# Altium schematic sheet Sheet1.SchDoc
size A1
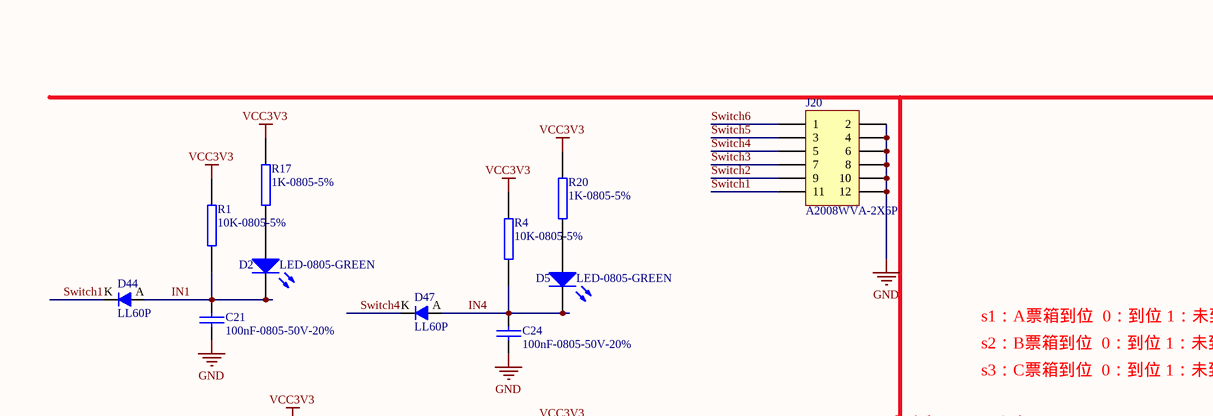
[diagram p0: Sheet1.SchDoc, top left]
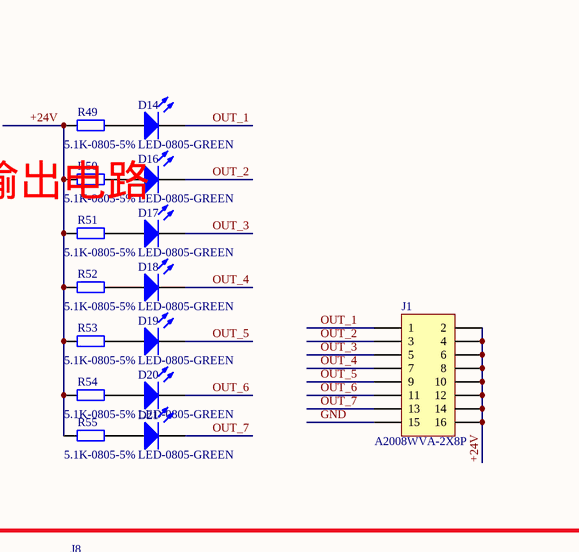
[diagram p1: Sheet1.SchDoc, top middle]
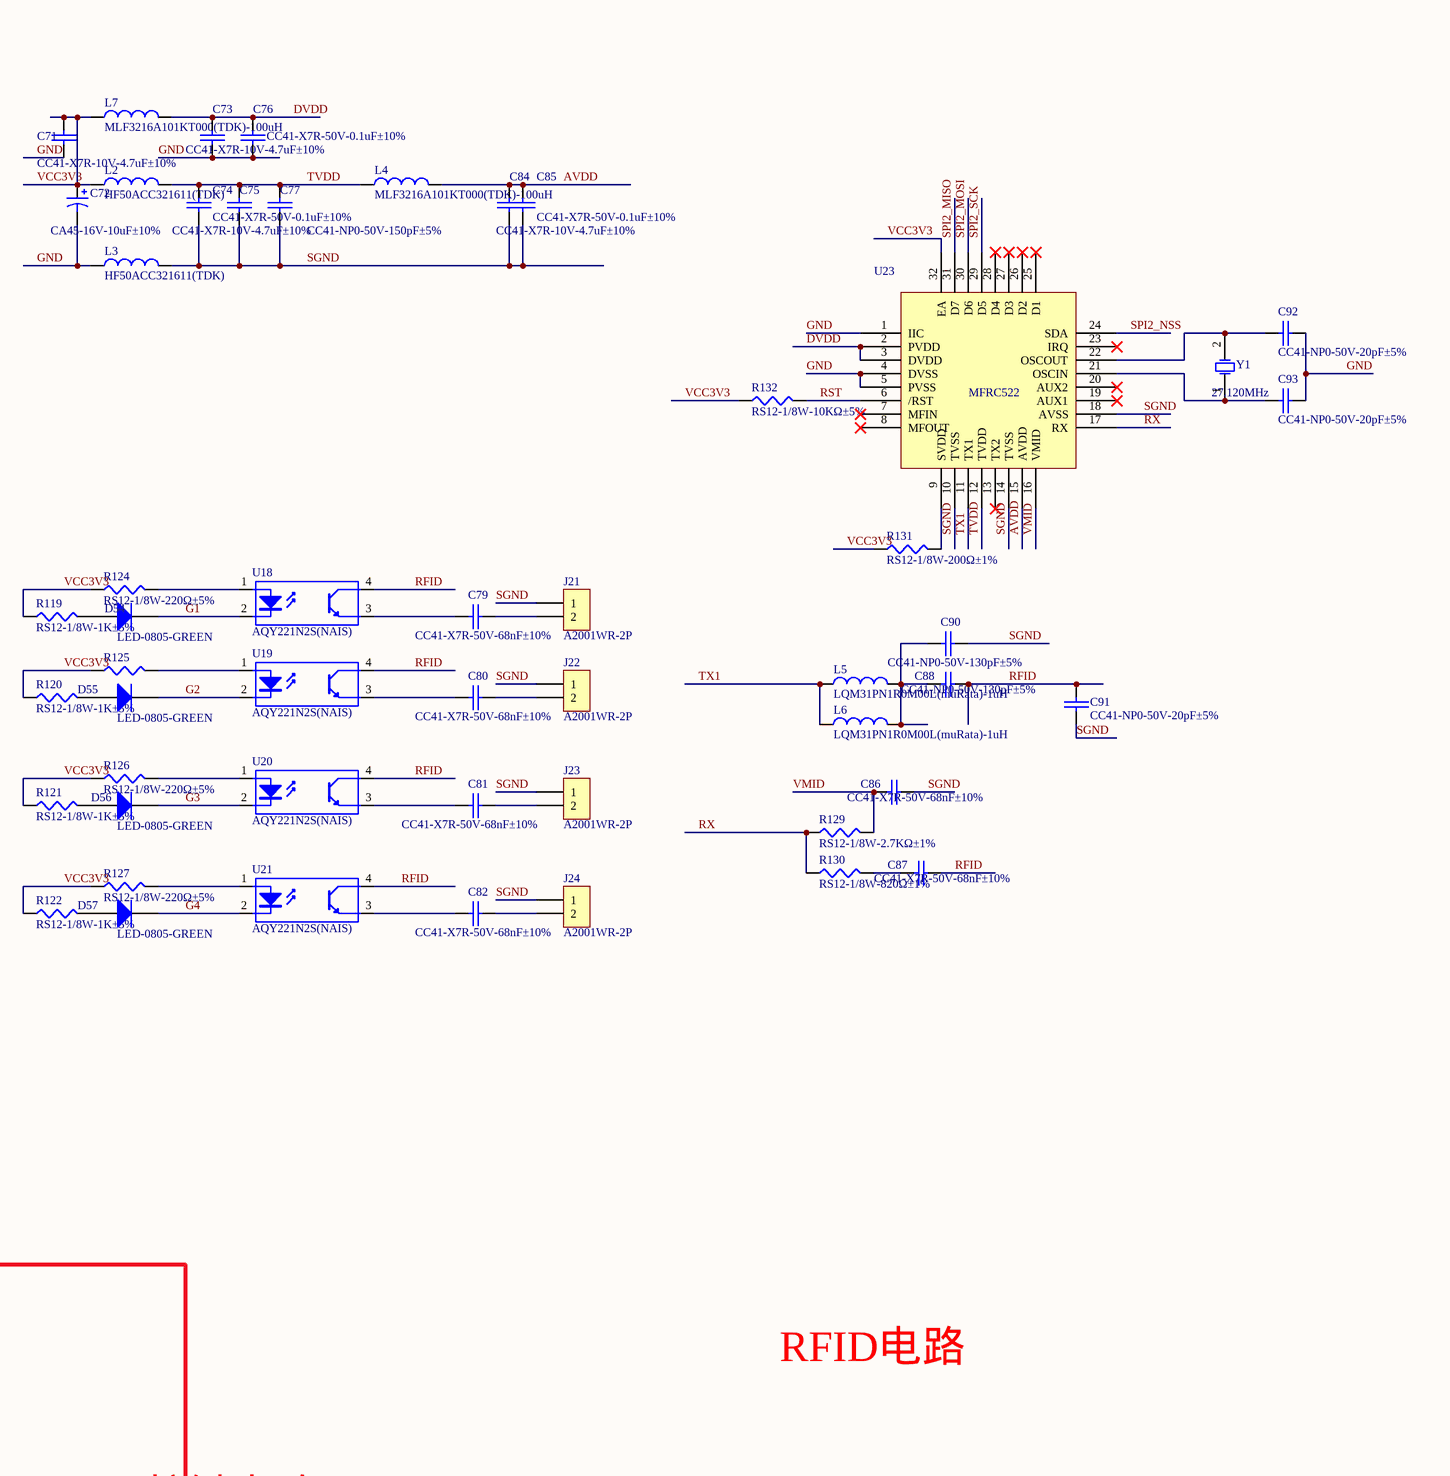
[diagram p2: Sheet1.SchDoc, top right]
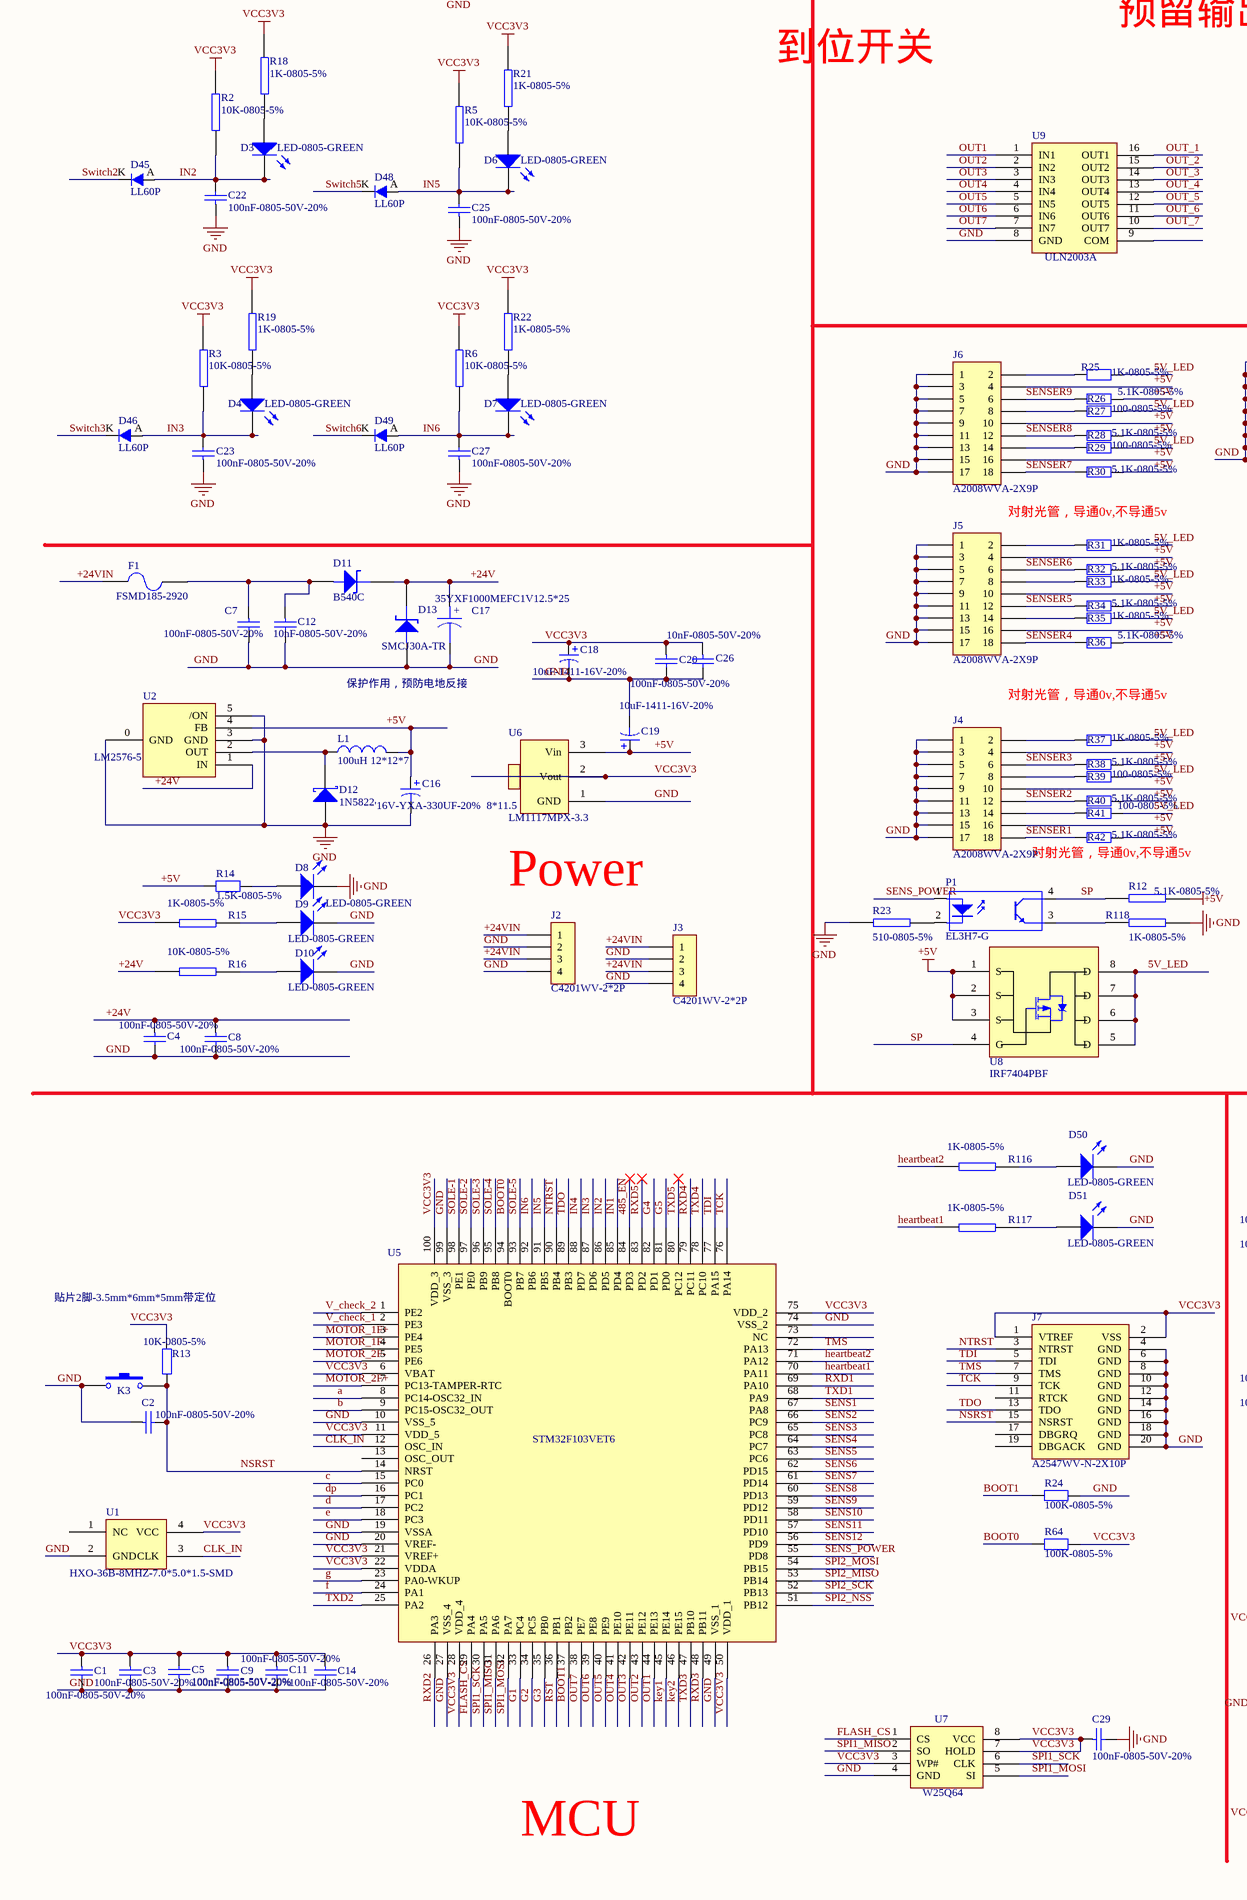
[diagram p3: Sheet1.SchDoc, bottom left]
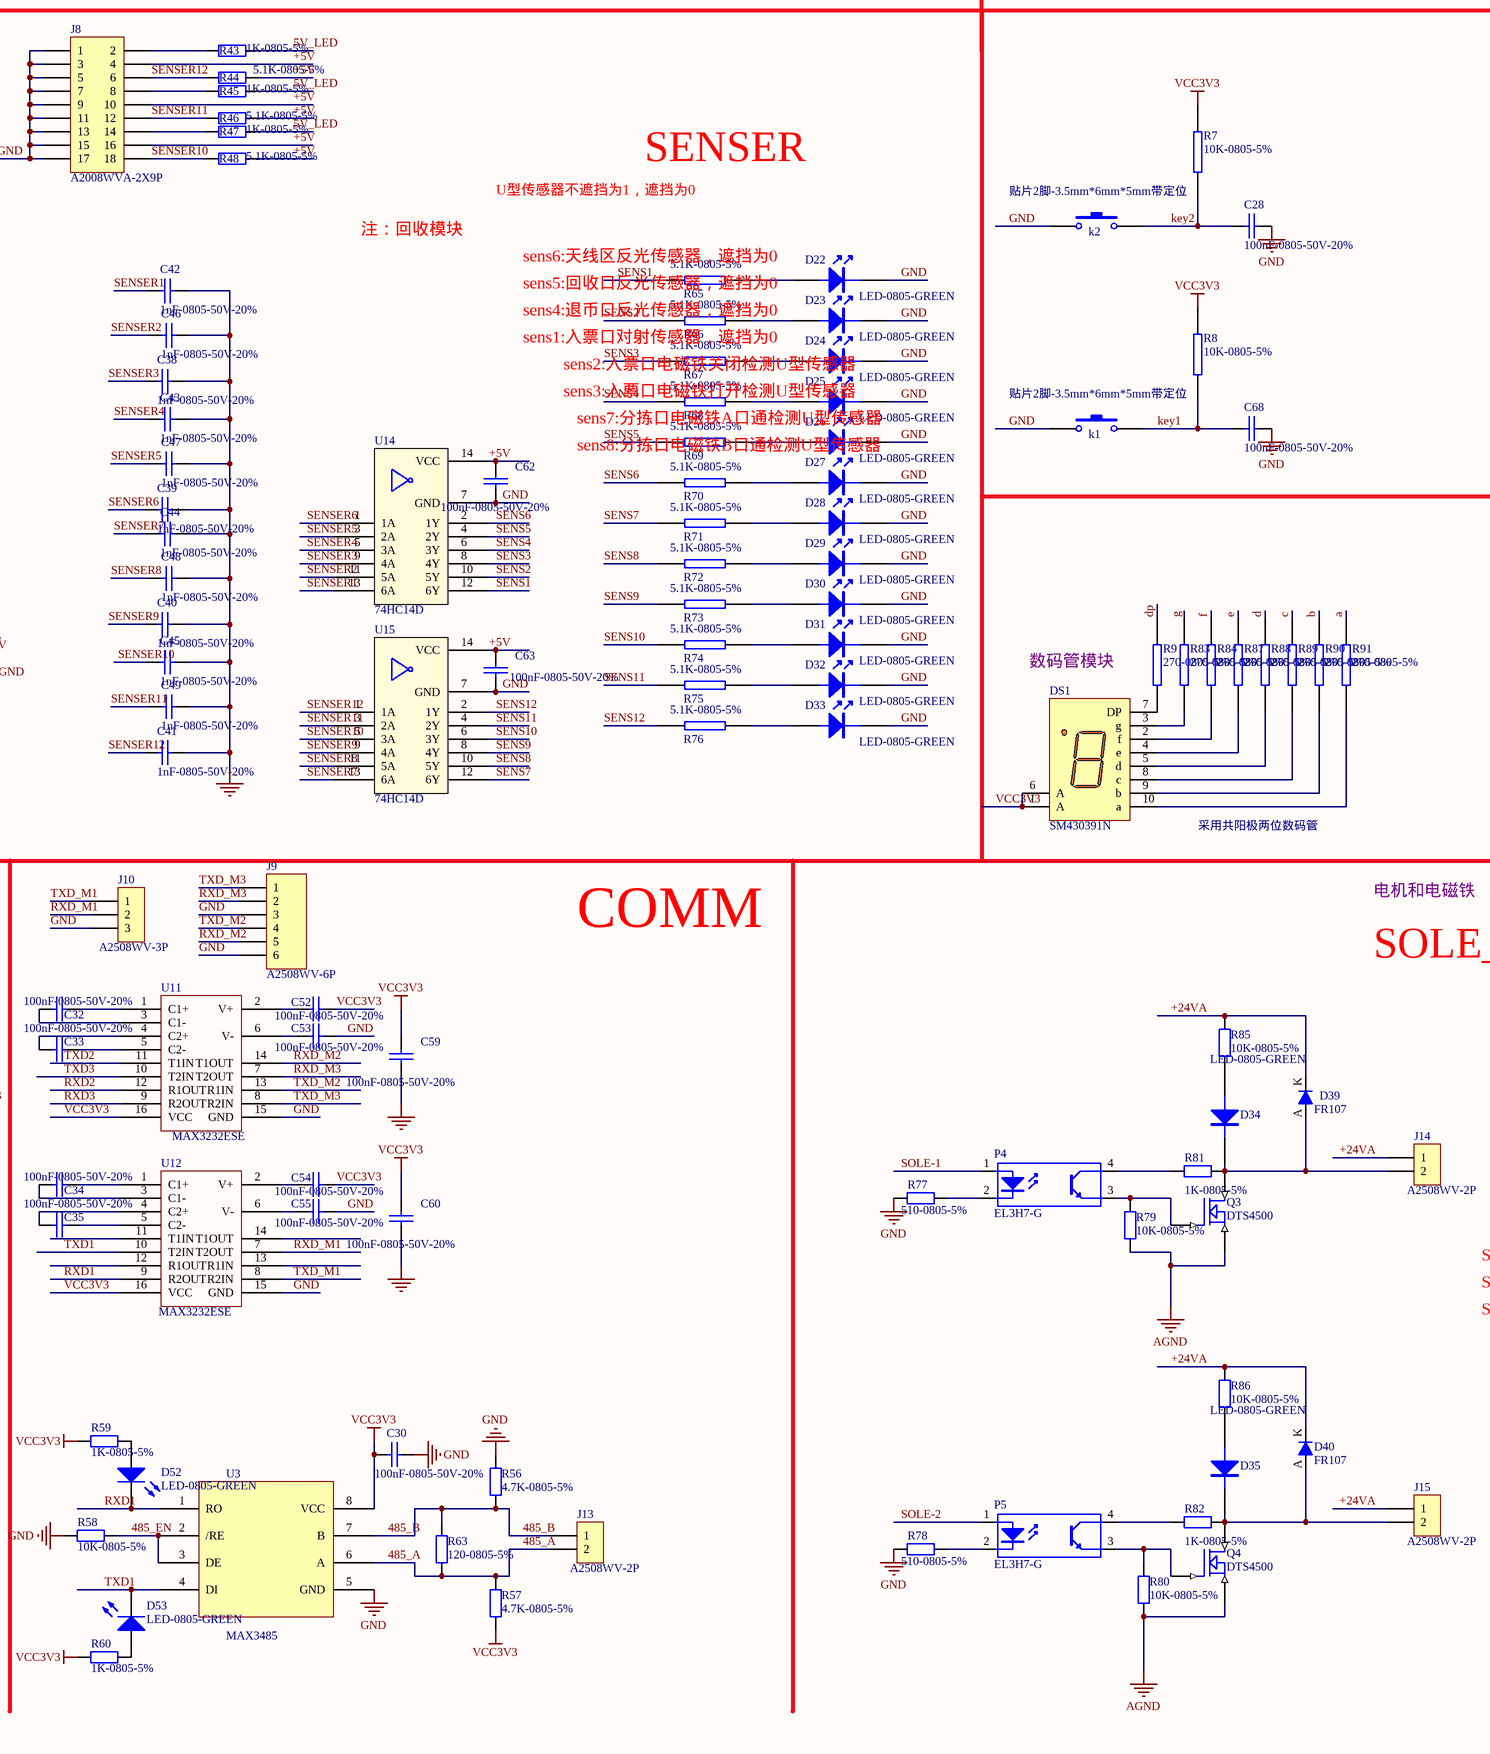
[diagram p4: Sheet1.SchDoc, bottom middle]
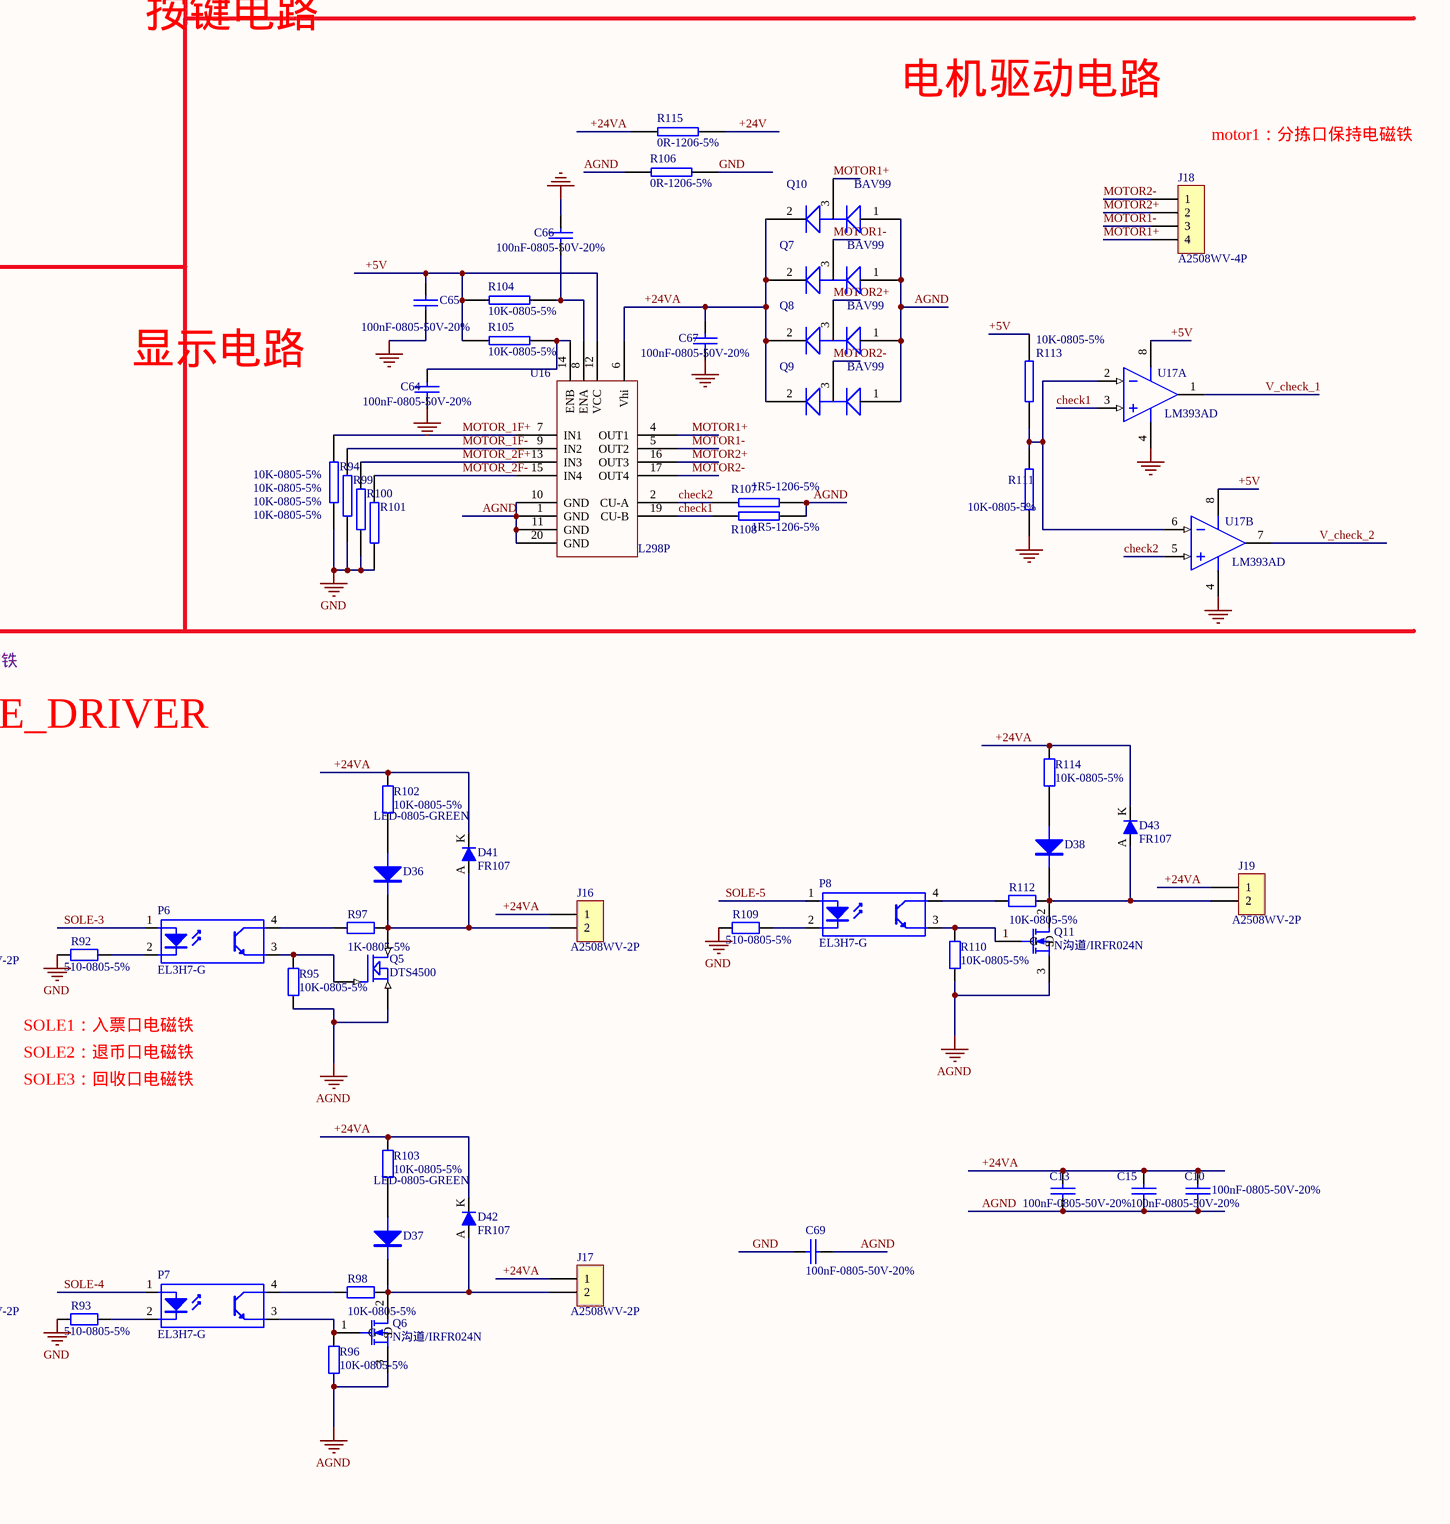
[diagram p5: Sheet1.SchDoc, bottom right]

## Parts
C1  100nF-0805-50V-20%  [0805]
C2  100nF-0805-50V-20%  [0805]
C3  100nF-0805-50V-20%  [0805]
C4  100nF-0805-50V-20%  [0805]
C5  100nF-0805-50V-20%  [0805]
C7  100nF-0805-50V-20%  [0805]
C8  100nF-0805-50V-20%  [0805]
C9  100nF-0805-50V-20%  [0805]
C10  100nF-0805-50V-20%  [0805]
C11  100nF-0805-50V-20%  [0805]
C12  10nF-0805-50V-20%  [0805]
C13  100nF-0805-50V-20%  [0805]
C14  100nF-0805-50V-20%  [0805]
C15  100nF-0805-50V-20%  [0805]
C16  '16V-YXA-330UF-20%  8*11.5  [RB.2/.4 - 8MM]
C17  35YXF1000MEFC1V12.5*25  [RB.2/.4]
C18  10uF-1411-16V-20%  [1411-B]
C19  10uF-1411-16V-20%  [1411-B]
C20  100nF-0805-50V-20%  [0805]
C21  100nF-0805-50V-20%  [0805]
C22  100nF-0805-50V-20%  [0805]
C23  100nF-0805-50V-20%  [0805]
C24  100nF-0805-50V-20%  [0805]
C25  100nF-0805-50V-20%  [0805]
C26  10nF-0805-50V-20%  [0805]
C27  100nF-0805-50V-20%  [0805]
C28  100nF-0805-50V-20%  [0805]
C29  100nF-0805-50V-20%  [0805]
C30  100nF-0805-50V-20%  [0805]
C32  100nF-0805-50V-20%  [0805]
C33  100nF-0805-50V-20%  [0805]
C34  100nF-0805-50V-20%  [0805]
C35  100nF-0805-50V-20%  [0805]
C38  1nF-0805-50V-20%  [0805]
C39  1nF-0805-50V-20%  [0805]
C40  1nF-0805-50V-20%  [0805]
C41  1nF-0805-50V-20%  [0805]
C42  1nF-0805-50V-20%  [0805]
C43  1nF-0805-50V-20%  [0805]
C44  1nF-0805-50V-20%  [0805]
C45  1nF-0805-50V-20%  [0805]
C46  1nF-0805-50V-20%  [0805]
C47  1nF-0805-50V-20%  [0805]
C48  1nF-0805-50V-20%  [0805]
C49  1nF-0805-50V-20%  [0805]
C52  100nF-0805-50V-20%  [0805]
C53  100nF-0805-50V-20%  [0805]
C54  100nF-0805-50V-20%  [0805]
C55  100nF-0805-50V-20%  [0805]
C59  100nF-0805-50V-20%  [0805]
C60  100nF-0805-50V-20%  [0805]
C62  100nF-0805-50V-20%  [0805]
C63  100nF-0805-50V-20%  [0805]
C64  100nF-0805-50V-20%  [0805]
C65  100nF-0805-50V-20%  [0805]
C66  100nF-0805-50V-20%  [0805]
C67  100nF-0805-50V-20%  [0805]
C68  100nF-0805-50V-20%  [0805]
C69  100nF-0805-50V-20%  [0805]
C71  CC41-X7R-10V-4.7uF±10%  [1206C]
C72  CA45-16V-10uF±10%  [3216-A]
C73  CC41-X7R-10V-4.7uF±10%  [1206C]
C74  CC41-X7R-10V-4.7uF±10%  [1206C]
C75  CC41-X7R-50V-0.1uF±10%  [0805C]
C76  CC41-X7R-50V-0.1uF±10%  [0805C]
C77  CC41-NP0-50V-150pF±5%  [0805C]
C79  CC41-X7R-50V-68nF±10%  [0805C]
C80  CC41-X7R-50V-68nF±10%  [0805C]
C81  CC41-X7R-50V-68nF±10%  [0805C]
C82  CC41-X7R-50V-68nF±10%  [0805C]
C84  CC41-X7R-10V-4.7uF±10%  [1206C]
C85  CC41-X7R-50V-0.1uF±10%  [0805C]
C86  CC41-X7R-50V-68nF±10%  [0805C]
C87  CC41-X7R-50V-68nF±10%  [0805C]
C88  CC41-NP0-50V-130pF±5%  [0805C]
C90  CC41-NP0-50V-130pF±5%  [0805C]
C91  CC41-NP0-50V-20pF±5%  [0805C]
C92  CC41-NP0-50V-20pF±5%  [0805C]
C93  CC41-NP0-50V-20pF±5%  [0805C]
D2  LED-0805-GREEN  [LED-0805]
D3  LED-0805-GREEN  [LED-0805]
D4  LED-0805-GREEN  [LED-0805]
D5  LED-0805-GREEN  [LED-0805]
D6  LED-0805-GREEN  [LED-0805]
D7  LED-0805-GREEN  [LED-0805]
D8  LED-0805-GREEN  [LED-0805]
D9  LED-0805-GREEN  [LED-0805]
D10  LED-0805-GREEN  [LED-0805]
D11  B540C  [SMC]
D12  1N5822  [IN5822 SMT]
D13  SMCJ30A-TR  [SMC]
D14  LED-0805-GREEN  [LED-0805]
D16  LED-0805-GREEN  [LED-0805]
D17  LED-0805-GREEN  [LED-0805]
D18  LED-0805-GREEN  [LED-0805]
D19  LED-0805-GREEN  [LED-0805]
D20  LED-0805-GREEN  [LED-0805]
D21  LED-0805-GREEN  [LED-0805]
D22  LED-0805-GREEN  [LED-0805]
D23  LED-0805-GREEN  [LED-0805]
D24  LED-0805-GREEN  [LED-0805]
D25  LED-0805-GREEN  [LED-0805]
D26  LED-0805-GREEN  [LED-0805]
D27  LED-0805-GREEN  [LED-0805]
D28  LED-0805-GREEN  [LED-0805]
D29  LED-0805-GREEN  [LED-0805]
D30  LED-0805-GREEN  [LED-0805]
D31  LED-0805-GREEN  [LED-0805]
D32  LED-0805-GREEN  [LED-0805]
D33  LED-0805-GREEN  [LED-0805]
D34  LED-0805-GREEN  [LED-0805]
D35  LED-0805-GREEN  [LED-0805]
D36  LED-0805-GREEN  [LED-0805]
D37  LED-0805-GREEN  [LED-0805]
D38  LED-0805-GREEN  [LED-0805]  (value not drawn)
D39  FR107  [DO-214AC]
D40  FR107  [DO-214AC]
D41  FR107  [DO-214AC]
D42  FR107  [DO-214AC]
D43  FR107  [DO-214AC]
D44  LL60P  [DIODE]
D45  LL60P  [DIODE]
D46  LL60P  [DIODE]
D47  LL60P  [DIODE]
D48  LL60P  [DIODE]
D49  LL60P  [DIODE]
D50  LED-0805-GREEN  [LED-0805]
D51  LED-0805-GREEN  [LED-0805]
D52  LED-0805-GREEN  [LED-0805]
D53  LED-0805-GREEN  [LED-0805]
D54  LED-0805-GREEN  [0805D]
D55  LED-0805-GREEN  [0805D]
D56  LED-0805-GREEN  [0805D]
D57  LED-0805-GREEN  [0805D]
DS1  SM430391N  [LEDDIP-10]
F1  FSMD185-2920  [2920]
J1  A2008WVA-2X8P  [A2008WVA-2X8P]
J2  C4201WV-2*2P  [MX4 .2- 2*2P-180]
J3  C4201WV-2*2P  [MX4 .2- 2*2P-180]
J4  A2008WVA-2X9P  [A2008WVA-2X9P]
J5  A2008WVA-2X9P  [A2008WVA-2X9P]
J6  A2008WVA-2X9P  [A2008WVA-2X9P]
J7  A2547WV-N-2X10P  [JTAG_20]
J8  A2008WVA-2X9P  [A2008WVA-2X9P]
J9  A2508WV-6P  [W143-6]
J10  A2508WV-3P  [H3]
J13  A2508WV-2P  [2.5-2P  180 JXT]
J14  A2508WV-2P  [2.5-2P  180 JXT]
J15  A2508WV-2P  [2.5-2P  180 JXT]
J16  A2508WV-2P  [2.5-2P  180 JXT]
J17  A2508WV-2P  [2.5-2P  180 JXT]
J18  A2508WV-4P  [W143-4]
J19  A2508WV-2P  [2.5-2P  180 JXT]
J20  A2008WVA-2X6P  [A2008WVA-2X6P]
J21  A2001WR-2P  [A2001WR-2P]
J22  A2001WR-2P  [A2001WR-2P]
J23  A2001WR-2P  [A2001WR-2P]
J24  A2001WR-2P  [A2001WR-2P]
k1  贴片2脚-3.5mm*6mm*5mm带定位  [BUTTON2]
k2  贴片2脚-3.5mm*6mm*5mm带定位  [BUTTON2]
K3  贴片2脚-3.5mm*6mm*5mm带定位  [BUTTON2]
L1  100uH 12*12*7  [Inductor SMT7]
L2  HF50ACC321611(TDK)  [1206L]
L3  HF50ACC321611(TDK)  [1206L]
L4  MLF3216A101KT000(TDK)-100uH  [1206L]
L5  LQM31PN1R0M00L(muRata)-1uH  [1206L]
L6  LQM31PN1R0M00L(muRata)-1uH  [1206L]
L7  MLF3216A101KT000(TDK)-100uH  [1206L]
P1  EL3H7-G  [SSOP4]
P4  EL3H7-G  [SSOP4]
P5  EL3H7-G  [SSOP4]
P6  EL3H7-G  [SSOP4]
P7  EL3H7-G  [SSOP4]
P8  EL3H7-G  [SSOP4]
Q3  DTS4500  [SOT-23]
Q4  DTS4500  [SOT-23]
Q5  DTS4500  [SOT-23]
Q6  N沟道/IRFR024N  [TO-252AA]
Q7  BAV99  [SOT-23]
Q8  BAV99  [SOT-23]
Q9  BAV99  [SOT-23]
Q10  BAV99  [SOT-23]
Q11  N沟道/IRFR024N  [TO-252AA]
R1  10K-0805-5%  [0805]
R2  10K-0805-5%  [0805]
R3  10K-0805-5%  [0805]
R4  10K-0805-5%  [0805]
R5  10K-0805-5%  [0805]
R6  10K-0805-5%  [0805]
R7  10K-0805-5%  [0805]
R8  10K-0805-5%  [0805]
R9  270-0805-5%  [0805]
R12  5.1K-0805-5%  [0805]
R13  10K-0805-5%  [0805]
R14  1.5K-0805-5%  [0805]
R15  1K-0805-5%  [0805]
R16  10K-0805-5%  [0805]
R17  1K-0805-5%  [0805]
R18  1K-0805-5%  [0805]
R19  1K-0805-5%  [0805]
R20  1K-0805-5%  [0805]
R21  1K-0805-5%  [0805]
R22  1K-0805-5%  [0805]
R23  510-0805-5%  [0805]
R24  100K-0805-5%  [0805]
R25  1K-0805-5%  [0805]
R26  5.1K-0805-5%  [0805]
R27  100-0805-5%  [0805]
R28  5.1K-0805-5%  [0805]
R29  100-0805-5%  [0805]
R30  5.1K-0805-5%  [0805]
R31  1K-0805-5%  [0805]
R32  5.1K-0805-5%  [0805]
R33  1K-0805-5%  [0805]
R34  5.1K-0805-5%  [0805]
R35  1K-0805-5%  [0805]
R36  5.1K-0805-5%  [0805]
R37  1K-0805-5%  [0805]
R38  5.1K-0805-5%  [0805]
R39  100-0805-5%  [0805]
R40  5.1K-0805-5%  [0805]
R41  100-0805-5%  [0805]
R42  5.1K-0805-5%  [0805]
R43  1K-0805-5%  [0805]
R44  5.1K-0805-5%  [0805]
R45  1K-0805-5%  [0805]
R46  5.1K-0805-5%  [0805]
R47  1K-0805-5%  [0805]
R48  5.1K-0805-5%  [0805]
R49  5.1K-0805-5%  [0805]
R50  5.1K-0805-5%  [0805]
R51  5.1K-0805-5%  [0805]
R52  5.1K-0805-5%  [0805]
R53  5.1K-0805-5%  [0805]
R54  5.1K-0805-5%  [0805]
R55  5.1K-0805-5%  [0805]
R56  4.7K-0805-5%  [0805]
R57  4.7K-0805-5%  [0805]
R58  10K-0805-5%  [0805]
R59  1K-0805-5%  [0805]
R60  1K-0805-5%  [0805]
R63  120-0805-5%  [0805]
R64  100K-0805-5%  [0805]
R65  5.1K-0805-5%  [0805]
R66  5.1K-0805-5%  [0805]
R67  5.1K-0805-5%  [0805]
R68  5.1K-0805-5%  [0805]
R69  5.1K-0805-5%  [0805]
R70  5.1K-0805-5%  [0805]
R71  5.1K-0805-5%  [0805]
R72  5.1K-0805-5%  [0805]
R73  5.1K-0805-5%  [0805]
R74  5.1K-0805-5%  [0805]
R75  5.1K-0805-5%  [0805]
R76  5.1K-0805-5%  [0805]
R77  510-0805-5%  [0805]
R78  510-0805-5%  [0805]
R79  10K-0805-5%  [0805]
R80  10K-0805-5%  [0805]
R81  1K-0805-5%  [0805]
R82  1K-0805-5%  [0805]
R83  270-0805-5%  [0805]
R84  270-0805-5%  [0805]
R85  10K-0805-5%  [0805]
R86  10K-0805-5%  [0805]
R87  270-0805-5%  [0805]
R88  270-0805-5%  [0805]
R89  270-0805-5%  [0805]
R90  270-0805-5%  [0805]
R91  270-0805-5%  [0805]
R92  510-0805-5%  [0805]
R93  510-0805-5%  [0805]
R94  10K-0805-5%  [0805]
R95  10K-0805-5%  [0805]
R96  10K-0805-5%  [0805]
R97  1K-0805-5%  [0805]
R98  10K-0805-5%  [0805]
R99  10K-0805-5%  [0805]
R100  10K-0805-5%  [0805]
R101  10K-0805-5%  [0805]
R102  10K-0805-5%  [0805]
R103  10K-0805-5%  [0805]
R104  10K-0805-5%  [0805]
R105  10K-0805-5%  [0805]
R106  0R-1206-5%  [1206]
R107  1R5-1206-5%  [1206]
R108  1R5-1206-5%  [1206]
R109  510-0805-5%  [0805]
R110  10K-0805-5%  [0805]
R111  10K-0805-5%  [0805]
R112  10K-0805-5%  [0805]
R113  10K-0805-5%  [0805]
R114  10K-0805-5%  [0805]
R115  0R-1206-5%  [1206]
R116  1K-0805-5%  [0805]
R117  1K-0805-5%  [0805]
R118  1K-0805-5%  [0805]
R119  RS12-1/8W-1K±5%  [0805R]
R120  RS12-1/8W-1K±5%  [0805R]
R121  RS12-1/8W-1K±5%  [0805R]
R122  RS12-1/8W-1K±5%  [0805R]
R124  RS12-1/8W-220Ω±5%  [0805R]
R125  RS12-1/8W-220Ω±5%  [0805R]  (value not drawn)
R126  RS12-1/8W-220Ω±5%  [0805R]
R127  RS12-1/8W-220Ω±5%  [0805R]
R129  RS12-1/8W-2.7KΩ±1%  [0805R]
R130  RS12-1/8W-820Ω±1%  [0805R]
R131  RS12-1/8W-200Ω±1%  [0805R]
R132  RS12-1/8W-10KΩ±5%  [0805R]
U1  HXO-36B-8MHZ-7.0*5.0*1.5-SMD  [OSC_4_S]
U2  LM2576-5  [TO-263]
U3  MAX3485  [SOP8]
U5  STM32F103VET6  [LQFP100_N]
U6  LM1117MPX-3.3  [SOT-223-3L]
U7  W25Q64  [SO-8M]
U8  IRF7404PBF  [SO-8]
U9  ULN2003A  [SO-16]
U11  MAX3232ESE  [SOIC-16]
U12  MAX3232ESE  [SOIC-16]
U14  74HC14D  [SO-14]
U15  74HC14D  [SO-14]
U16  L298P  [POWERSO20_N]
U17  LM393AD  [SO-8]  (parts A,B of 2)
U18  AQY221N2S(NAIS)  [SOP-4]
U19  AQY221N2S(NAIS)  [SOP-4]
U20  AQY221N2S(NAIS)  [SOP-4]
U21  AQY221N2S(NAIS)  [SOP-4]
U23  MFRC522  [QFN-32]
Y1  27.120MHz  [XTAL]

## Nets
+5V: C16.1 C19.1 C62.1 C63.1 C65.1 J4.4 J4.10 J4.16 J5.4 J5.10 J5.16 J6.4 J6.10 J6.16 J8.4 J8.10 J8.16 L1.2 R12.1 R14.1 R26.1 R28.1 R30.1 R32.1 R34.1 R36.1 R38.1 R40.1 R42.1 R44.1 R46.1 R48.1 R104.1 R105.1 R113.1 U2.4(FB) U6.3(Vin) U8.1(S) U8.2(S) U8.3(S) U14.14(VCC) U15.14(VCC) U16.12(VCC) U17.8(V+)
AGND: C10.2 C13.2 C15.2 C64.2 C65.2 C67.2 C69.2 Q3.2(S) Q4.2(S) Q5.2(S) Q6.3(S) Q7.1 Q8.1 Q9.1 Q10.1 Q11.3(S) R79.2 R80.2 R95.2 R96.2 R106.1 R107.2 R108.2 R110.2 U16.1(GND) U16.10(GND) U16.11(GND) U16.20(GND)
GND: C1.2 C2.1 C3.2 C4.2 C5.1 C7.2 C8.2 C9.2 C11.2 C12.2 C14.2 C16.2 C17.2 C18.2 C19.2 C20.2 C21.1 C22.1 C23.1 C24.1 C25.1 C26.2 C27.1 C28.2 C29.2 C30.2 C38.2 C39.2 C40.2 C41.2 C42.2 C43.2 C44.2 C45.2 C46.2 C47.2 C48.2 C49.2 C53.2 C55.2 C59.2 C60.2 C62.2 C63.2 C66.1 C68.2 C69.1 C71.1 C72.2 C73.1 C76.1 C92.1 C93.1 D8.2(K) D9.2(K) D10.2(K) D12.1(A) D13.1(A) D22.2(K) D23.2(K) D24.2(K) D25.2(K) D26.2(K) D27.2(K) D28.2(K) D29.2(K) D30.2(K) D31.2(K) D32.2(K) D33.2(K) D50.2(K) D51.2(K) J1.15 J2.2 J2.4 J3.2 J3.4 J4.1 J4.3 J4.5 J4.7 J4.9 J4.11 J4.13 J4.15 J4.17 J5.1 J5.3 J5.5 J5.7 J5.9 J5.11 J5.13 J5.15 J5.17 J6.1 J6.3 J6.5 J6.7 J6.9 J6.11 J6.13 J6.15 J6.17 J7.4(GND) J7.6(GND) J7.8(GND) J7.10(GND) J7.12(GND) J7.14(GND) J7.16(GND) J7.18(GND) J7.20(GND) J8.1 J8.3 J8.5 J8.7 J8.9 J8.11 J8.13 J8.15 J8.17 J9.3 J9.6 J10.3 J20.2 J20.4 J20.6 J20.8 J20.10 J20.12 k1.1 k2.1 K3.1 L3.1 R23.2 R24.1 R56.1 R58.1 R77.2 R78.2 R92.2 R93.2 R94.1 R99.1 R100.1 R101.1 R106.2 R109.2 R111.2 R118.1 U1.2(GND) U2.0(GND) U2.3(GND) U2.5(/ON) U3.5(GND) U5.10(VSS_5) U5.19(VSSA) U5.20(VREF-) U5.27(VSS_4) U5.49(VSS_1) U5.74(VSS_2) U5.99(VSS_3) U6.1(GND) U7.4(GND) U9.8(GND) U11.15(GND) U12.15(GND) U14.7(GND) U15.7(GND) U17.4(V-) U23.1(IIC) U23.4(DVSS) U23.5(PVSS)
VCC3V3: C1.1 C3.1 C5.2 C9.1 C11.1 C14.1 C18.1 C20.1 C26.1 C29.1 C30.1 C52.2 C54.2 C59.1 C60.1 C71.2 C72.1 DS1.1(A) DS1.6(A) J7.1(VTREF) J7.2(VSS) L2.1 L7.1 R1.1 R2.1 R3.1 R4.1 R5.1 R6.1 R7.1 R8.1 R13.2 R15.1 R17.1 R18.1 R19.1 R20.1 R21.1 R22.1 R57.2 R59.2 R60.2 R64.1 R119.1 R120.1 R121.1 R122.1 R124.1 R125.1 R126.1 R127.1 R131.1 R132.1 U1.4(VCC) U3.8(VCC) U5.6(VBAT) U5.11(VDD_5) U5.21(VREF+) U5.22(VDDA) U5.28(VDD_4) U5.50(VDD_1) U5.75(VDD_2) U5.100(VDD_3) U6.2(Vout) U6.4 U7.3(WP#) U7.7(HOLD) U7.8(VCC) U11.16(VCC) U12.16(VCC) U23.32(EA)
5V_LED: R25.1 R27.1 R29.1 R31.1 R33.1 R35.1 R37.1 R39.1 R41.1 R43.1 R45.1 R47.1 U8.5(D) U8.6(D) U8.7(D) U8.8(D)
485_A: J13.2 R57.1 R63.2 U3.6(A)
485_B: J13.1 R56.2 R63.1 U3.7(B)
485_EN: R58.2 U3.2(/RE) U3.3(DE) U5.84(PD3)
+24V: C4.1 C8.1 C17.1 D11.2(K) D13.2(K) J1.2 J1.4 J1.6 J1.8 J1.10 J1.12 J1.14 J1.16 R16.1 R49.2 R50.2 R51.2 R52.2 R53.2 R54.2 R55.2 R115.2 U2.1(IN)
+24VA: C10.1 C13.1 C15.1 C67.1 D39.K D40.K D41.K D42.K D43.K J14.1 J15.1 J16.1 J17.1 J19.1 Q7.2 Q8.2 Q9.2 Q10.2 R85.1 R86.1 R102.1 R103.1 R114.1 R115.1 U16.6(Vhi)
+24VIN: F1.1 J2.1 J2.3 J3.1 J3.3
a: R91.1 U5.8(PC14-OSC32_IN)
AVDD: C84.2 C85.2 L4.2 U23.15(AVDD)
b: R90.1 U5.9(PC15-OSC32_OUT)
BOOT0: R64.2 U5.94(BOOT0)
BOOT1: R24.2 U5.37(PB2)
c: R89.1 U5.15(PC0)
check1: R108.1 U16.19(CU-B) U17.3(IN+)
check2: R107.1 U16.2(CU-A) U17.5(IN+)
CLK_IN: U1.3(CLK) U5.12(OSC_IN)
d: R88.1 U5.17(PC2)
dp: R9.1 U5.16(PC1)
DVDD: C73.2 C76.2 L7.2 U23.2(PVDD) U23.3(DVDD)
e: R87.1 U5.18(PC3)
f: R84.1 U5.24(PA1)
FLASH_CS: U5.29(PA4) U7.1(CS)
g: R83.1 U5.23(PA0-WKUP)
G1: D54.2(K) U5.33(PC4) U18.2(K)
G2: D55.2(K) U5.34(PC5) U19.2(K)
G3: D56.2(K) U5.35(PB0) U20.2(K)
G4: D57.2(K) U5.82(PD1) U21.2(K)
G5: U5.81(PD0)
heartbeat1: R117.1 U5.70(PA11)
heartbeat2: R116.1 U5.71(PA12)
IN1: C21.2 D2.2(K) D44.A R1.2 U5.85(PD4)
IN2: C22.2 D3.2(K) D45.A R2.2 U5.86(PD5)
IN3: C23.2 D4.2(K) D46.A R3.2 U5.87(PD6)
IN4: C24.2 D5.2(K) D47.A R4.2 U5.88(PD7)
IN5: C25.2 D6.2(K) D48.A R5.2 U5.91(PB5)
IN6: C27.2 D7.2(K) D49.A R6.2 U5.92(PB6)
key1: C68.1 k1.2 R8.2 U5.45(PE14)
key2: C28.1 k2.2 R7.2 U5.46(PE15)
MOTOR1+: J18.4 Q10.3 U16.4(OUT1)
MOTOR1-: J18.3 Q7.3 U16.5(OUT2)
MOTOR2+: J18.2 Q8.3 U16.16(OUT3)
MOTOR2-: J18.1 Q9.3 U16.17(OUT4)
MOTOR_1F+: R94.2 U5.3(PE4) U16.7(IN1)
MOTOR_1F-: R99.2 U5.4(PE5) U16.9(IN2)
MOTOR_2F+: R100.2 U5.7(PC13-TAMPER-RTC) U16.13(IN3)
MOTOR_2F-: R101.2 U5.5(PE6) U16.15(IN4)
NSRST: C2.2 J7.15(NSRST) K3.2 R13.1 U5.14(NRST)
NTRST: J7.3(NTRST) U5.90(PB4)
OUT1: U5.44(PE13) U9.1(IN1)
OUT2: U5.43(PE12) U9.2(IN2)
OUT3: U5.42(PE11) U9.3(IN3)
OUT4: U5.41(PE10) U9.4(IN4)
OUT5: U5.40(PE9) U9.5(IN5)
OUT6: U5.39(PE8) U9.6(IN6)
OUT7: U5.38(PE7) U9.7(IN7)
OUT_1: D14.2(K) J1.1 U9.16(OUT1)
OUT_2: D16.2(K) J1.3 U9.15(OUT2)
OUT_3: D17.2(K) J1.5 U9.14(OUT3)
OUT_4: D18.2(K) J1.7 U9.13(OUT4)
OUT_5: D19.2(K) J1.9 U9.12(OUT5)
OUT_6: D20.2(K) J1.11 U9.11(OUT6)
OUT_7: D21.2(K) J1.13 U9.10(OUT7)
RFID: C87.2 C88.2 C91.2 U18.4(C) U19.4(C) U20.4(C) U21.4(C)
RST: R132.2 U5.36(PB1) U23.6(/RST)
RX: R129.1 R130.1 U23.17(RX)
RXD1: D52.2(K) U3.1(RO) U5.69(PA10) U12.9(R2OUT)
RXD2: U5.26(PA3) U11.12(R1OUT)
RXD3: U5.48(PB11) U11.9(R2OUT)
RXD4: U5.79(PC11)
RXD5: U5.83(PD2)
RXD_M1: J10.2 U12.7(T2OUT)
RXD_M2: J9.5 U11.14(T1OUT)
RXD_M3: J9.2 U11.7(T2OUT)
SENS1: R65.1 U5.67(PA8) U14.12(6Y)
SENS2: R66.1 U5.66(PC9) U14.10(5Y)
SENS3: R67.1 U5.65(PC8) U14.8(4Y)
SENS4: R68.1 U5.64(PC7) U14.6(3Y)
SENS5: R69.1 U5.63(PC6) U14.4(2Y)
SENS6: R70.1 U5.62(PD15) U14.2(1Y)
SENS7: R71.1 U5.61(PD14) U15.12(6Y)
SENS8: R72.1 U5.60(PD13) U15.10(5Y)
SENS9: R73.1 U5.59(PD12) U15.8(4Y)
SENS10: R74.1 U5.58(PD11) U15.6(3Y)
SENS11: R75.1 U5.57(PD10) U15.4(2Y)
SENS12: R76.1 U5.56(PD9) U15.2(1Y)
SENS_POWER: P1.1(A) U5.55(PD8)
SENSER1: C42.1 J4.18 R42.2 U14.13(6A)
SENSER2: C46.1 J4.12 R40.2 U14.11(5A)
SENSER3: C38.1 J4.6 R38.2 U14.9(4A)
SENSER4: C43.1 J5.18 R36.2 U14.5(3A)
SENSER5: C47.1 J5.12 R34.2 U14.3(2A)
SENSER6: C39.1 J5.6 R32.2 U14.1(1A)
SENSER7: C44.1 J6.18 R30.2 U15.13(6A)
SENSER8: C48.1 J6.12 R28.2 U15.11(5A)
SENSER9: C40.1 J6.6 R26.2 U15.9(4A)
SENSER10: C45.1 J8.18 R48.2 U15.5(3A)
SENSER11: C49.1 J8.12 R46.2 U15.3(2A)
SENSER12: C41.1 J8.6 R44.2 U15.1(1A)
SGND: C74.1 C75.1 C77.1 C84.1 C85.1 C86.2 C90.2 C91.1 J21.1 J22.1 J23.1 J24.1 L3.2 U23.10(TVSS) U23.14(TVSS) U23.18(AVSS)
SOLE-1: P4.1(A) U5.98(PE1)
SOLE-2: P5.1(A) U5.97(PE0)
SOLE-3: P6.1(A) U5.96(PB9)
SOLE-4: P7.1(A) U5.95(PB8)
SOLE-5: P8.1(A) U5.93(PB7)
SP: P1.4(C) R12.2 U8.4(G)
SPI1_MISO: U5.31(PA6) U7.2(SO)
SPI1_MOSI: U5.32(PA7) U7.5(SI)
SPI1_SCK: U5.30(PA5) U7.6(CLK)
SPI2_MISO: U5.53(PB14) U23.31(D7)
SPI2_MOSI: U5.54(PB15) U23.30(D6)
SPI2_NSS: U5.51(PB12) U23.24(SDA)
SPI2_SCK: U5.52(PB13) U23.29(D5)
Switch1: D44.K J20.11
Switch2: D45.K J20.9
Switch3: D46.K J20.7
Switch4: D47.K J20.5
Switch5: D48.K J20.3
Switch6: D49.K J20.1
TCK: J7.9(TCK) U5.76(PA14)
TDI: J7.5(TDI) U5.77(PA15)
TDO: J7.13(TDO) U5.89(PB3)
TMS: J7.7(TMS) U5.72(PA13)
TVDD: C74.2 C75.2 C77.2 L2.2 L4.1 U23.12(TVDD)
TX1: L5.1 L6.1 U23.11(TX1)
TXD1: D53.2(K) U3.4(DI) U5.68(PA9) U12.10(T2IN)
TXD2: U5.25(PA2) U11.11(T1IN)
TXD3: U5.47(PB10) U11.10(T2IN)
TXD4: U5.78(PC10)
TXD5: U5.80(PC12)
TXD_M1: J10.1 U12.8(R2IN)
TXD_M2: J9.4 U11.13(R1IN)
TXD_M3: J9.1 U11.8(R2IN)
V_check_1: U5.2(PE3) U17.1(OUT)
V_check_2: U5.1(PE2) U17.7(OUT)
VMID: C86.1 R129.2 U23.16(VMID)
NetC7_1: C7.1 C12.1 D11.1(A) F1.2
NetC32_1: C32.1 U11.3(C1-)
NetC32_2: C32.2 U11.1(C1+)
NetC33_1: C33.1 U11.4(C2+)
NetC33_2: C33.2 U11.5(C2-)
NetC34_1: C34.1 U12.3(C1-)
NetC34_2: C34.2 U12.1(C1+)
NetC35_1: C35.1 U12.4(C2+)
NetC35_2: C35.2 U12.5(C2-)
NetC52_1: C52.1 U11.2(V+)
NetC53_1: C53.1 U11.6(V-)
NetC54_1: C54.1 U12.2(V+)
NetC55_1: C55.1 U12.6(V-)
NetC64_1: C64.1 R105.2 U16.14(ENB)
NetC66_2: C66.2 R104.2 U16.8(ENA)
NetC79_1: C79.1 U18.3(E)
NetC79_2: C79.2 J21.2
NetC80_1: C80.1 U19.3(E)
NetC80_2: C80.2 J22.2
NetC81_1: C81.1 U20.3(E)
NetC81_2: C81.2 J23.2
NetC82_1: C82.1 U21.3(E)
NetC82_2: C82.2 J24.2
NetC87_1: C87.1 R130.2
NetC88_1: C88.1 C90.1 L5.2 L6.2
NetC92_2: C92.2 U23.22(OSCOUT) Y1.2(OSC2)
NetC93_2: C93.2 U23.21(OSCIN) Y1.1(OSC1)
NetD2_1: D2.1(A) R17.2
NetD3_1: D3.1(A) R18.2
NetD4_1: D4.1(A) R19.2
NetD5_1: D5.1(A) R20.2
NetD6_1: D6.1(A) R21.2
NetD7_1: D7.1(A) R22.2
NetD8_1: D8.1(A) R14.2
NetD9_1: D9.1(A) R15.2
NetD10_1: D10.1(A) R16.2
NetD12_2: D12.2(K) L1.1 U2.2(OUT)
NetD14_1: D14.1(A) R49.1
NetD16_1: D16.1(A) R50.1
NetD17_1: D17.1(A) R51.1
NetD18_1: D18.1(A) R52.1
NetD19_1: D19.1(A) R53.1
NetD20_1: D20.1(A) R54.1
NetD21_1: D21.1(A) R55.1
NetD22_1: D22.1(A) R65.2
NetD23_1: D23.1(A) R66.2
NetD24_1: D24.1(A) R67.2
NetD25_1: D25.1(A) R68.2
NetD26_1: D26.1(A) R69.2
NetD27_1: D27.1(A) R70.2
NetD28_1: D28.1(A) R71.2
NetD29_1: D29.1(A) R72.2
NetD30_1: D30.1(A) R73.2
NetD31_1: D31.1(A) R74.2
NetD32_1: D32.1(A) R75.2
NetD33_1: D33.1(A) R76.2
NetD34_1: D34.1(A) R85.2
NetD34_2: D34.2(K) D39.A J14.2 Q3.3(D) R81.2
NetD35_1: D35.1(A) R86.2
NetD35_2: D35.2(K) D40.A J15.2 Q4.3(D) R82.2
NetD36_1: D36.1(A) R102.2
NetD36_2: D36.2(K) D41.A J16.2 Q5.3(D) R97.2
NetD37_1: D37.1(A) R103.2
NetD37_2: D37.2(K) D42.A J17.2 Q6.2(D) R98.2
NetD38_1: D38.1(A) R114.2
NetD38_2: D38.2(K) D43.A J19.2 Q11.2(D) R112.2
NetD50_1: D50.1(A) R116.2
NetD51_1: D51.1(A) R117.2
NetD52_1: D52.1(A) R59.1
NetD53_1: D53.1(A) R60.1
NetD54_1: D54.1(A) R119.2
NetD55_1: D55.1(A) R120.2
NetD56_1: D56.1(A) R121.2
NetD57_1: D57.1(A) R122.2
NetDS1_2: DS1.2(f) R84.2
NetDS1_3: DS1.3(g) R83.2
NetDS1_4: DS1.4(e) R87.2
NetDS1_5: DS1.5(d) R88.2
NetDS1_7: DS1.7(DP) R9.2
NetDS1_8: DS1.8(c) R89.2
NetDS1_9: DS1.9(b) R90.2
NetDS1_10: DS1.10(a) R91.2
NetJ4_2: J4.2 R37.2
NetJ4_8: J4.8 R39.2
NetJ4_14: J4.14 R41.2
NetJ5_2: J5.2 R31.2
NetJ5_8: J5.8 R33.2
NetJ5_14: J5.14 R35.2
NetJ6_2: J6.2 R25.2
NetJ6_8: J6.8 R27.2
NetJ6_14: J6.14 R29.2
NetJ8_2: J8.2 R43.2
NetJ8_8: J8.8 R45.2
NetJ8_14: J8.14 R47.2
NetP1_2: P1.2(K) R23.1
NetP1_3: P1.3(E) R118.2
NetP4_2: P4.2(K) R77.1
NetP4_3: P4.3(E) Q3.1(G) R79.1
NetP4_4: P4.4(C) R81.1
NetP5_2: P5.2(K) R78.1
NetP5_3: P5.3(E) Q4.1(G) R80.1
NetP5_4: P5.4(C) R82.1
NetP6_2: P6.2(K) R92.1
NetP6_3: P6.3(E) Q5.1(G) R95.1
NetP6_4: P6.4(C) R97.1
NetP7_2: P7.2(K) R93.1
NetP7_3: P7.3(E) Q6.1(G) R96.1
NetP7_4: P7.4(C) R98.1
NetP8_2: P8.2(K) R109.1
NetP8_3: P8.3(E) Q11.1(G) R110.1
NetP8_4: P8.4(C) R112.1
NetR111_1: R111.1 R113.2 U17.2(IN-) U17.6(IN-)
NetR124_2: R124.2 U18.1(A)
NetR125_2: R125.2 U19.1(A)
NetR126_2: R126.2 U20.1(A)
NetR127_2: R127.2 U21.1(A)
NetR131_2: R131.2 U23.9(SVDD)

Not connected (* = marked no-connect by the designer): J7 11(RTCK) 17(DBGRQ) 19(DBGACK); U1 1(NC); U5 13(OSC_OUT) 73(NC); U9 9(COM); U12 11(T1IN) 12(R1OUT) 13(R1IN) 14(T1OUT); U23 7(MFIN)* 8(MFOUT)* 13(TX2)* 19(AUX1)* 20(AUX2)* 23(IRQ)* 25(D1)* 26(D2)* 27(D3)* 28(D4)*

## Notes on the sheet
- s1：A票箱到位  0：到位 1：未到位
- s2：B票箱到位  0：到位 1：未到位
- s3：C票箱到位  0：到位 1：未到位
- 预留输出电路
- 到位开关
- RFID电路
- 对射光管，导通0v,不导通5v
- U型传感器不遮挡为1，遮挡为0
- SENSER
- 注：回收模块
- sens6:天线区反光传感器，遮挡为0
- sens5:回收口反光传感器，遮挡为0
- 按键电路
- sens4:退币口反光传感器，遮挡为0
- sens1:入票口对射传感器，遮挡为0
- 电机驱动电路
- 保护作用，预防电地反接
- sens2:入票口电磁铁关闭检测U型传感器
- sens3:入票口电磁铁打开检测U型传感器
- sens7:分拣口电磁铁A口通检测U型传感器
- motor1：分拣口保持电磁铁
- (near U14) sens8:分拣口电磁铁B口通检测U型传感器
- (near R42) 对射光管，导通0v,不导通5v
- 显示电路
- Power
- (near DS1) 数码管模块
- 采用共阳极两位数码管
- 电机和电磁铁
- COMM
- SOLE_DRIVER
- SOLE1：入票口电磁铁
- SOLE2：退币口电磁铁
- SOLE3：回收口电磁铁
- MCU
- (in symbol CAPACITOR POL) +

## Library data of the parts
C1-C5 C7-C15 C20-C30 C32-C35 C38-C49 C52-C55 C59 C60 C62-C69 C71 C73-C77 C79-C82 C84-C88 C90-C93 = CAP: Capacitor
C16 = Cap Pol1: Polarized Capacitor (Radial); Value: 330uF/25V; Published: 8-Jun-2000; LatestRevisionDate: 17-Jul-2002; LatestRevisionNote: Re-released for DXP Platform.; Publisher: Altium Limited
C17 = CAPACITOR POL: Capacitor
C18 C19 C72 = Cap Pol1: Polarized Capacitor (Radial); Published: 8-Jun-2000; LatestRevisionDate: 17-Jul-2002; LatestRevisionNote: Re-released for DXP Platform.; PackageReference: RB7.6-15; Publisher: Altium Limited
  C18 C19: Value: 10uF-1411-16V-20%
  C72: PackageDescription: Polarized Capacitor (Radial); 2 Leads; Value: CA45-16V-10uF±10%
D2-D10 D14 D16-D21 D50-D53 = LED0: Typical INFRARED GaAs LED; Published: 8-Jun-2000; LatestRevisionDate: 08-Jul-2005; LatestRevisionNote: Mech Layer 1 removed.; PackageReference: LED-0; Publisher: Altium Limited
D11 D13 = ZENER2: Zener Diode
D12 = D Schottky: Schottky Diode; Published: 8-Jun-2000; LatestRevisionDate: 17-Jul-2002; LatestRevisionNote: Re-released for DXP Platform.; Publisher: Altium Limited; Code_JEDEC: DO-214-AA
D22-D33 = LED
D34-D38 = DIODE
D39-D49 = 1N4148
D54-D57 = Diode: Default Diode; Published: 8-Jun-2000; LatestRevisionDate: 17-Jul-2002; LatestRevisionNote: Re-released for DXP Platform.; PackageVersion: Sep-1996; PackageReference: SMC; Publisher: Altium Limited; PackageDescription: DO-214-AB/SMC; 2 C-Bend Leads; Body 7.9 x 5.9 mm, inc. leads (LxW); Code_JEDEC: DO-214-AB
DS1 = Dpy Amber-CA: 7.62 mm Black Surface Orange 7-Segment Display: CA, RH DP; MinimumIntensity: 354 ucd; Note: IF = 5 mA; Note: Pins 1 and 6 are redundant Anodes.; Published: 8-Jun-2000; LatestRevisionDate: 17-Dec-2003; LatestRevisionNote: Schematic revised, PCB Footprint replaced.; DatasheetDocument: 19-Feb-2002; PackageDocument: 19-Feb-2002; PackageReference: LEDDIP-10; Publisher: Altium Limited; Colour: Orange; ComponentLink1Description: Manufacturer Link; ComponentLink1URL: http://www.agilent.com/
F1 = FUSE2: Fuse
J1 = Header 8X2: Header, 8-Pin, Dual row; LatestRevisionDate: 17-Jul-2002; LatestRevisionNote: Re-released for DXP Platform.; Publisher: Altium Limited
J2 J3 J18 = CON4: Connector
J4-J6 J8 = Header 9X2: Header, 9-Pin, Dual row; LatestRevisionDate: 17-Jul-2002; LatestRevisionNote: Re-released for DXP Platform.; Publisher: Altium Limited
J7 = JTAG
J9 = Header 6: Header, 6-Pin; LatestRevisionDate: 17-Jul-2002; LatestRevisionNote: Re-released for DXP Platform.; Publisher: Altium Limited
J10 = CON3: Connector
J13-J17 J19 J21-J24 = CON2
J20 = Header 6X2: Header, 6-Pin, Dual row; LatestRevisionDate: 17-Jul-2002; LatestRevisionNote: Re-released for DXP Platform.; Publisher: Altium Limited
k1 k2 K3 = Switch
L1-L7 = Inductor: Code_IEC: 1005; Published: 8-Jun-2000; PackageReference: 0402-A; Publisher: Altium Limited; Code_JEITA: 0402
  L1: LatestRevisionDate: 17-Jul-2002; LatestRevisionNote: Re-released for DXP Platform.; Value: 100uH
  L2 L3: LatestRevisionDate: 29-May-2009; LatestRevisionNote: IPC-7351 Footprint Added.; PackageDescription: Chip Inductor; Value: HF50ACC321611(TDK)
  L4 L7: LatestRevisionDate: 29-May-2009; LatestRevisionNote: IPC-7351 Footprint Added.; PackageDescription: Chip Inductor; Value: MLF3216A101KT000(TDK)-100uH
  L5 L6: LatestRevisionDate: 29-May-2009; LatestRevisionNote: IPC-7351 Footprint Added.; PackageDescription: Chip Inductor; Value: LQM31PN1R0M00L(muRata)-1uH
P1 P4-P8 U18-U21 = OpticalCoupler
Q3-Q5 = MOSFET N
Q6 Q11 = MOSFET-N: N-Channel MOSFET; Published: 8-Jun-2000; LatestRevisionDate: 17-Jul-2002; LatestRevisionNote: Re-released for DXP Platform.; PackageVersion: 1995/1996; PackageReference: E3; Publisher: Altium Limited; PackageDescription: TO, Flat Index; 3 In-Line, Axial Leads; Body Dia. 4.6mm; Lead Dia. 0.5 mm (max)
R1-R9 R12 R15-R23 R65-R76 R83 R84 R87-R91 R94 R99-R101 R104-R108 R111 R113 R115-R118 = RES2
R13 R24-R60 R63 R64 R77 R78 R85 R86 R92 R93 R102 R103 R109 R114 = Res2: Resistor; Published: 8-Jun-2000; LatestRevisionDate: 17-Jul-2002; LatestRevisionNote: Re-released for DXP Platform.; PackageReference: AXIAL-0.4; Publisher: Altium Limited
R14 = Res2: Resistor; Value: 1.5K; Published: 8-Jun-2000; LatestRevisionDate: 17-Jul-2002; LatestRevisionNote: Re-released for DXP Platform.; PackageReference: AXIAL-0.4; Publisher: Altium Limited
R79-R82 R95-R98 R110 R112 = Res2: Resistor; Value: 10K; Published: 8-Jun-2000; LatestRevisionDate: 17-Jul-2002; LatestRevisionNote: Re-released for DXP Platform.; PackageReference: AXIAL-0.4; Publisher: Altium Limited
R119-R122 R124-R127 R129-R132 = Res3: Resistor; Published: 8-Jun-2000; LatestRevisionDate: 29-May-2009; LatestRevisionNote: IPC-7351 Footprint Added.; PackageReference: J1-0603; Publisher: Altium Limited; PackageDescription: Chip Resistor
  R119-R122: Value: RS12-1/8W-1K±5%
  R124-R127: Value: RS12-1/8W-220Ω±5%
  R129: Value: RS12-1/8W-2.7KΩ±1%
  R130: Value: RS12-1/8W-820Ω±1%
  R131: Value: RS12-1/8W-200Ω±1%
  R132: Value: RS12-1/8W-10KΩ±5%
U1 = CRYSTAL
U2 = LM2576: TO-263
U8 = sop8(IRF7404)
U9 = ULN2003: Darlinton BJT Array
U11 U12 = SPI3232E
U14 U15 = 74HC04: Hex Inverters
U17 = LM393AD: Low-Power Dual Voltage Comparator; Published: 24-Aug-2001; LatestRevisionDate: 13-Apr-2006; LatestRevisionNote: IPC-7351 Footprint Added.; DatasheetVersion: Nov-1992; PackageVersion: Dec-2002; PackageReference: SO8; Publisher: Altium Limited; PackageDescription: 8-Pin Small Outline Integrated Circuit 1.27 mm Pitch; Code_JEDEC: MS-012-AA; Code_IPC: SOIC127P600-8; ComponentLink1Description: Manufacturer Link; ComponentLink1URL: http://www.st.com/; ComponentLink2Description: Datasheet; ComponentLink2URL: http://www.st.com/stonline/products/literature/ds/2164/lm193.pdf
U23 = RC522
Y1 = XTAL: Crystal Oscillator; Published: 8-Jun-2000; LatestRevisionDate: 17-Jul-2002; LatestRevisionNote: Re-released for DXP Platform.; PackageReference: R38; Publisher: Altium Limited; PackageDescription: Crystal, Thru-Hole; 2 Leads; Body 3.1 x 8.2 mm (Dia.xH)
U5 = STM32F103VET6: Value: STM32F103VET6